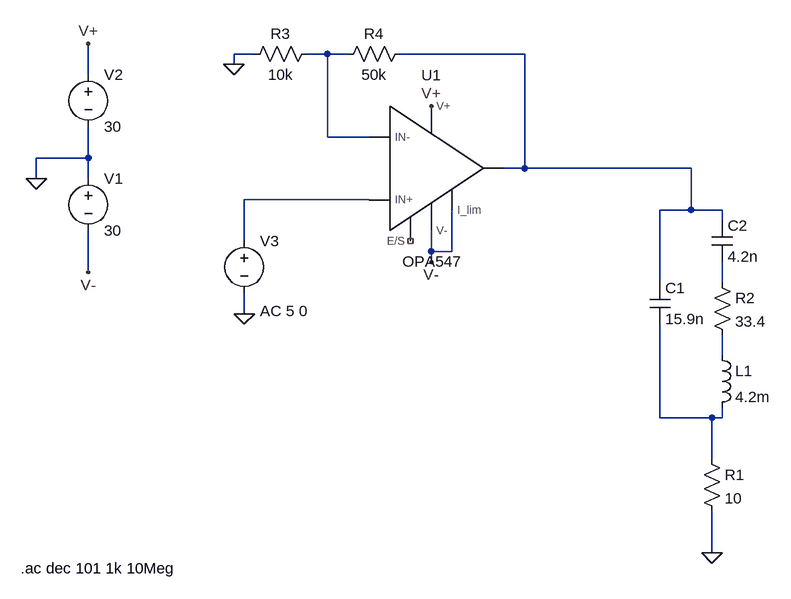
[diagram p0: schematic z_measurement_opa547.asc]
z_measurement_opa547.asc, the LTspice schematic file:
Version 4
SHEET 1 880 680
WIRE -576 -272 -608 -272
WIRE -464 -272 -496 -272
WIRE -432 -272 -464 -272
WIRE -160 -272 -352 -272
WIRE -608 -256 -608 -272
WIRE -832 -240 -832 -288
WIRE -464 -144 -464 -272
WIRE -400 -144 -464 -144
WIRE -832 -112 -832 -160
WIRE -832 -112 -912 -112
WIRE -160 -96 -160 -272
WIRE -160 -96 -192 -96
WIRE 96 -96 -160 -96
WIRE -912 -80 -912 -112
WIRE -832 -80 -832 -112
WIRE -400 -48 -592 -48
WIRE 96 -32 96 -96
WIRE 96 -32 48 -32
WIRE 144 -32 96 -32
WIRE 144 -16 144 -32
WIRE -592 16 -592 -48
WIRE -304 32 -304 0
WIRE -272 32 -272 -32
WIRE -272 32 -304 32
WIRE -304 48 -304 32
WIRE -832 64 -832 0
WIRE 48 80 48 -32
WIRE 144 80 144 48
WIRE -592 128 -592 96
WIRE 144 192 144 160
WIRE 48 288 48 144
WIRE 128 288 48 288
WIRE 144 288 144 272
WIRE 144 288 128 288
WIRE 128 352 128 288
WIRE 128 496 128 432
FLAG 128 496 0
FLAG -912 -80 0
FLAG -832 -288 V+
FLAG -832 64 V-
FLAG -592 128 0
FLAG -608 -256 0
FLAG -304 -192 V+
FLAG -304 48 V-
SYMBOL res 112 336 R0
SYMATTR InstName R1
SYMATTR Value 10
SYMBOL cap 32 80 R0
SYMATTR InstName C1
SYMATTR Value 15.9n
SYMBOL cap 128 -16 R0
SYMATTR InstName C2
SYMATTR Value 4.2n
SYMBOL res 128 64 R0
SYMATTR InstName R2
SYMATTR Value 33.4
SYMBOL ind 128 176 R0
SYMATTR InstName L1
SYMATTR Value 4.2m
SYMBOL voltage -832 -96 R0
WINDOW 123 0 0 Left 0
WINDOW 39 0 0 Left 0
SYMATTR InstName V1
SYMATTR Value 30
SYMBOL voltage -832 -256 R0
WINDOW 123 0 0 Left 0
WINDOW 39 0 0 Left 0
SYMATTR InstName V2
SYMATTR Value 30
SYMBOL voltage -592 0 R0
WINDOW 123 24 124 Left 2
WINDOW 39 0 0 Left 0
SYMATTR Value2 AC 5 0
SYMATTR InstName V3
SYMATTR Value ""
SYMBOL res -480 -288 R90
WINDOW 0 0 56 VBottom 2
WINDOW 3 32 56 VTop 2
SYMATTR InstName R3
SYMATTR Value 10k
SYMBOL res -336 -288 R90
WINDOW 0 0 56 VBottom 2
WINDOW 3 32 56 VTop 2
SYMATTR InstName R4
SYMATTR Value 50k
SYMBOL OPA547 -336 -48 R0
SYMATTR InstName U1
SYMATTR SpiceModel C:\Dev\TAUV-Hardware\TAUV-Lib\LTspice\opa547.lib
TEXT -936 520 Left 2 !.ac dec 101 1k 10Meg

The netlist it stands for:
* z_measurement_opa547.asc
R1 N006 0 10
C1 N002 N006 15.9n
C2 N002 N004 4.2n
R2 N004 N005 33.4
L1 N005 N006 4.2m
V1 0 V- 30
V2 V+ 0 30
V3 N003 0 AC 5 0
R3 N001 0 10k
R4 N002 N001 50k
XU1 N003 N001 V- V- V+ N002 NC_01 OPA547  ; pins IN+ IN- I_lim V- V+ 6 E/S
.ac dec 101 1k 10Meg
.lib C:\Dev\TAUV-Hardware\TAUV-Lib\LTspice\opa547.lib
.backanno
.end